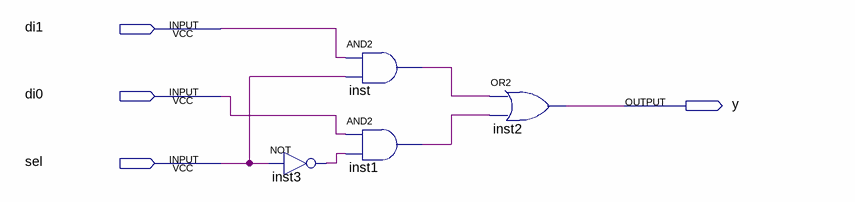
[diagram p0: schematic sheet]
// Quartus schematic mux2to1.bdf as structural Verilog: 4 symbols, 4 pins
module mux2to1 (
  input  di1,
  input  di0,
  input  sel,
  output y
);

  wire inst1_out, inst3_out, inst_out;

  not inst3 (inst3_out, sel);
  and inst (inst_out, di1, sel);
  and inst1 (inst1_out, di0, inst3_out);
  or inst2 (y, inst_out, inst1_out);
endmodule
